# EAGLE schematic LEDMatrixi (EAGLE 9.6.2)
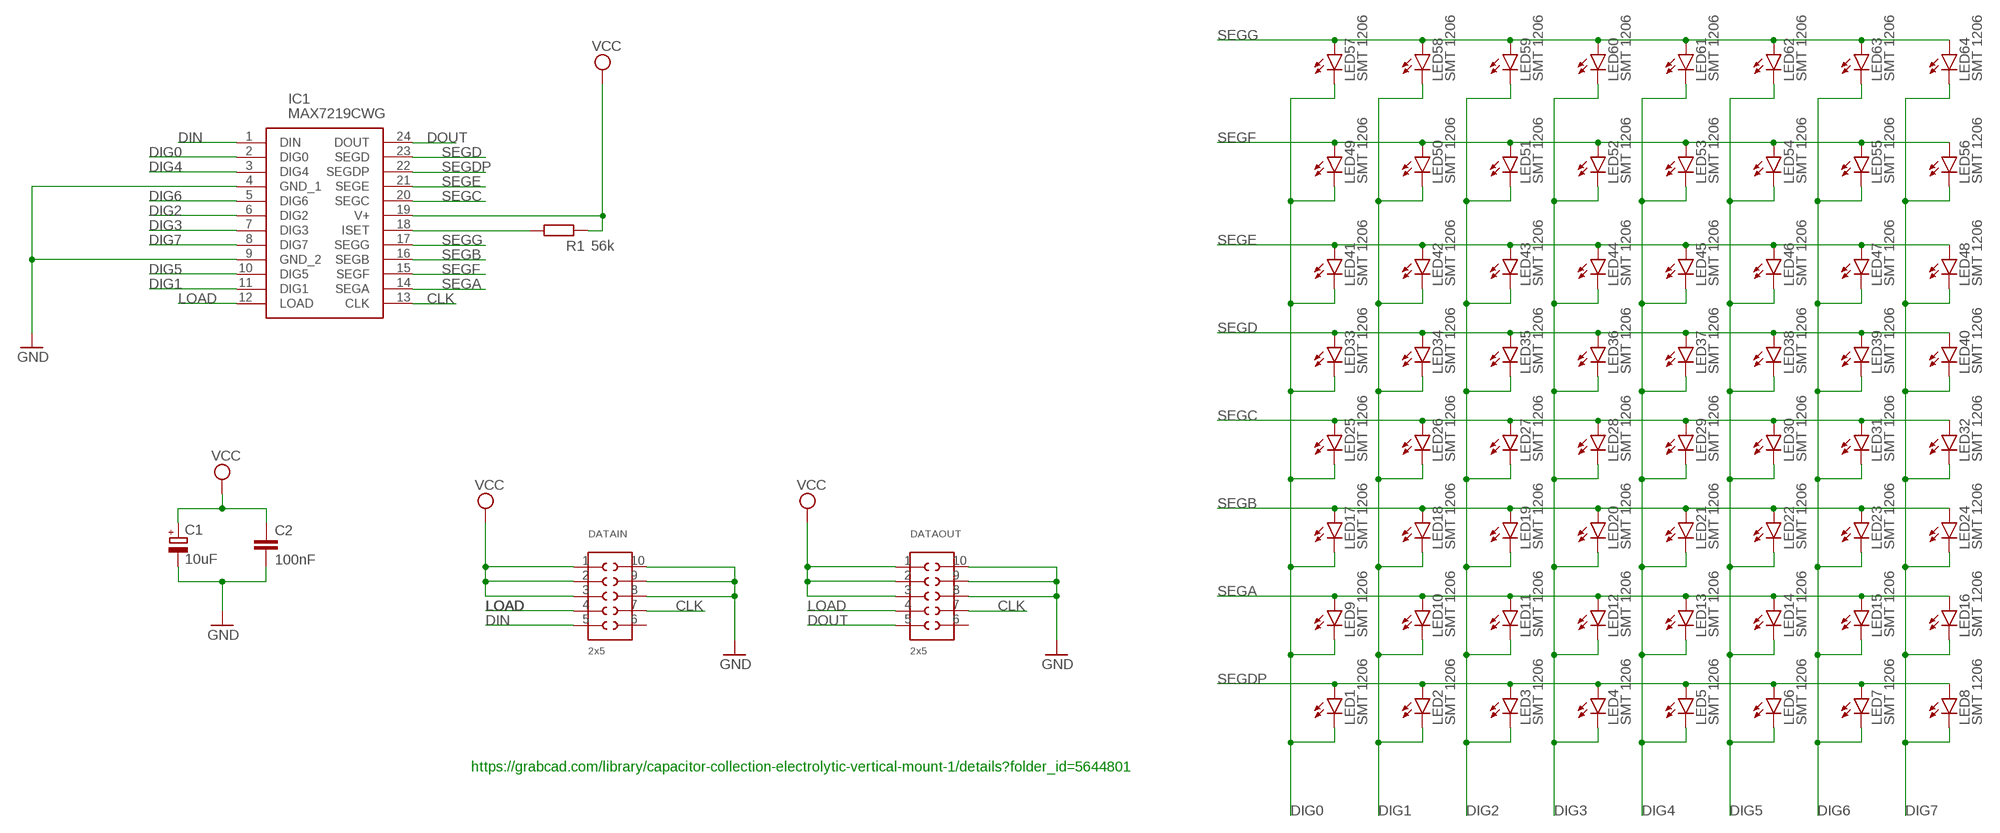
[diagram p0: schematic, sheet 1]

## Parts
C1  10uF  CPOL-EUE5-8.5  [E5-8,5]
C2  100nF  C-EUC1206  [C1206]
DATAIN  2x5  610X1021121  [610X1021121]
DATAOUT  2x5  610X1021121  [610X1021121]
IC1  MAX7219CWG  [SOIC127P1032X265-24N]
LED1  SMT 1206  LEDCHIPLED_1206  [CHIPLED_1206]
LED2  SMT 1206  LEDCHIPLED_1206  [CHIPLED_1206]
LED3  SMT 1206  LEDCHIPLED_1206  [CHIPLED_1206]
LED4  SMT 1206  LEDCHIPLED_1206  [CHIPLED_1206]
LED5  SMT 1206  LEDCHIPLED_1206  [CHIPLED_1206]
LED6  SMT 1206  LEDCHIPLED_1206  [CHIPLED_1206]
LED7  SMT 1206  LEDCHIPLED_1206  [CHIPLED_1206]
LED8  SMT 1206  LEDCHIPLED_1206  [CHIPLED_1206]
LED9  SMT 1206  LEDCHIPLED_1206  [CHIPLED_1206]
LED10  SMT 1206  LEDCHIPLED_1206  [CHIPLED_1206]
LED11  SMT 1206  LEDCHIPLED_1206  [CHIPLED_1206]
LED12  SMT 1206  LEDCHIPLED_1206  [CHIPLED_1206]
LED13  SMT 1206  LEDCHIPLED_1206  [CHIPLED_1206]
LED14  SMT 1206  LEDCHIPLED_1206  [CHIPLED_1206]
LED15  SMT 1206  LEDCHIPLED_1206  [CHIPLED_1206]
LED16  SMT 1206  LEDCHIPLED_1206  [CHIPLED_1206]
LED17  SMT 1206  LEDCHIPLED_1206  [CHIPLED_1206]
LED18  SMT 1206  LEDCHIPLED_1206  [CHIPLED_1206]
LED19  SMT 1206  LEDCHIPLED_1206  [CHIPLED_1206]
LED20  SMT 1206  LEDCHIPLED_1206  [CHIPLED_1206]
LED21  SMT 1206  LEDCHIPLED_1206  [CHIPLED_1206]
LED22  SMT 1206  LEDCHIPLED_1206  [CHIPLED_1206]
LED23  SMT 1206  LEDCHIPLED_1206  [CHIPLED_1206]
LED24  SMT 1206  LEDCHIPLED_1206  [CHIPLED_1206]
LED25  SMT 1206  LEDCHIPLED_1206  [CHIPLED_1206]
LED26  SMT 1206  LEDCHIPLED_1206  [CHIPLED_1206]
LED27  SMT 1206  LEDCHIPLED_1206  [CHIPLED_1206]
LED28  SMT 1206  LEDCHIPLED_1206  [CHIPLED_1206]
LED29  SMT 1206  LEDCHIPLED_1206  [CHIPLED_1206]
LED30  SMT 1206  LEDCHIPLED_1206  [CHIPLED_1206]
LED31  SMT 1206  LEDCHIPLED_1206  [CHIPLED_1206]
LED32  SMT 1206  LEDCHIPLED_1206  [CHIPLED_1206]
LED33  SMT 1206  LEDCHIPLED_1206  [CHIPLED_1206]
LED34  SMT 1206  LEDCHIPLED_1206  [CHIPLED_1206]
LED35  SMT 1206  LEDCHIPLED_1206  [CHIPLED_1206]
LED36  SMT 1206  LEDCHIPLED_1206  [CHIPLED_1206]
LED37  SMT 1206  LEDCHIPLED_1206  [CHIPLED_1206]
LED38  SMT 1206  LEDCHIPLED_1206  [CHIPLED_1206]
LED39  SMT 1206  LEDCHIPLED_1206  [CHIPLED_1206]
LED40  SMT 1206  LEDCHIPLED_1206  [CHIPLED_1206]
LED41  SMT 1206  LEDCHIPLED_1206  [CHIPLED_1206]
LED42  SMT 1206  LEDCHIPLED_1206  [CHIPLED_1206]
LED43  SMT 1206  LEDCHIPLED_1206  [CHIPLED_1206]
LED44  SMT 1206  LEDCHIPLED_1206  [CHIPLED_1206]
LED45  SMT 1206  LEDCHIPLED_1206  [CHIPLED_1206]
LED46  SMT 1206  LEDCHIPLED_1206  [CHIPLED_1206]
LED47  SMT 1206  LEDCHIPLED_1206  [CHIPLED_1206]
LED48  SMT 1206  LEDCHIPLED_1206  [CHIPLED_1206]
LED49  SMT 1206  LEDCHIPLED_1206  [CHIPLED_1206]
LED50  SMT 1206  LEDCHIPLED_1206  [CHIPLED_1206]
LED51  SMT 1206  LEDCHIPLED_1206  [CHIPLED_1206]
LED52  SMT 1206  LEDCHIPLED_1206  [CHIPLED_1206]
LED53  SMT 1206  LEDCHIPLED_1206  [CHIPLED_1206]
LED54  SMT 1206  LEDCHIPLED_1206  [CHIPLED_1206]
LED55  SMT 1206  LEDCHIPLED_1206  [CHIPLED_1206]
LED56  SMT 1206  LEDCHIPLED_1206  [CHIPLED_1206]
LED57  SMT 1206  LEDCHIPLED_1206  [CHIPLED_1206]
LED58  SMT 1206  LEDCHIPLED_1206  [CHIPLED_1206]
LED59  SMT 1206  LEDCHIPLED_1206  [CHIPLED_1206]
LED60  SMT 1206  LEDCHIPLED_1206  [CHIPLED_1206]
LED61  SMT 1206  LEDCHIPLED_1206  [CHIPLED_1206]
LED62  SMT 1206  LEDCHIPLED_1206  [CHIPLED_1206]
LED63  SMT 1206  LEDCHIPLED_1206  [CHIPLED_1206]
LED64  SMT 1206  LEDCHIPLED_1206  [CHIPLED_1206]
R1  56k  R-EU_R1206  [R1206]

## Nets
CLK: DATAIN.7 DATAOUT.7 IC1.13(CLK)
DIG0: IC1.2(DIG0) LED1.C LED9.C LED17.C LED25.C LED33.C LED41.C LED49.C LED57.C
DIG1: IC1.11(DIG1) LED2.C LED10.C LED18.C LED26.C LED34.C LED42.C LED50.C LED58.C
DIG2: IC1.6(DIG2) LED3.C LED11.C LED19.C LED27.C LED35.C LED43.C LED51.C LED59.C
DIG3: IC1.7(DIG3) LED4.C LED12.C LED20.C LED28.C LED36.C LED44.C LED52.C LED60.C
DIG4: IC1.3(DIG4) LED5.C LED13.C LED21.C LED29.C LED37.C LED45.C LED53.C LED61.C
DIG5: IC1.10(DIG5) LED6.C LED14.C LED22.C LED30.C LED38.C LED46.C LED54.C LED62.C
DIG6: IC1.5(DIG6) LED7.C LED15.C LED23.C LED31.C LED39.C LED47.C LED55.C LED63.C
DIG7: IC1.8(DIG7) LED8.C LED16.C LED24.C LED32.C LED40.C LED48.C LED56.C LED64.C
DIN: DATAIN.5 IC1.1(DIN)
DOUT: DATAOUT.5 IC1.24(DOUT)
GND: C1.- C2.2 DATAIN.8 DATAIN.9 DATAIN.10 DATAOUT.8 DATAOUT.9 DATAOUT.10 IC1.4(GND_1) IC1.9(GND_2)
LOAD: DATAIN.4 DATAOUT.4 IC1.12(LOAD)
N$2: IC1.18(ISET) R1.1
SEGA: IC1.14(SEGA) LED9.A LED10.A LED11.A LED12.A LED13.A LED14.A LED15.A LED16.A
SEGB: IC1.16(SEGB) LED17.A LED18.A LED19.A LED20.A LED21.A LED22.A LED23.A LED24.A
SEGC: IC1.20(SEGC) LED25.A LED26.A LED27.A LED28.A LED29.A LED30.A LED31.A LED32.A
SEGD: IC1.23(SEGD) LED33.A LED34.A LED35.A LED36.A LED37.A LED38.A LED39.A LED40.A
SEGDP: IC1.22(SEGDP) LED1.A LED2.A LED3.A LED4.A LED5.A LED6.A LED7.A LED8.A
SEGE: IC1.21(SEGE) LED41.A LED42.A LED43.A LED44.A LED45.A LED46.A LED47.A LED48.A
SEGF: IC1.15(SEGF) LED49.A LED50.A LED51.A LED52.A LED53.A LED54.A LED55.A LED56.A
SEGG: IC1.17(SEGG) LED57.A LED58.A LED59.A LED60.A LED61.A LED62.A LED63.A LED64.A
VCC: C1.+ C2.1 DATAIN.1 DATAIN.2 DATAIN.3 DATAOUT.1 DATAOUT.2 DATAOUT.3 IC1.19(V+) R1.2
Unconnected: DATAIN.6 DATAOUT.6

## Notes on the sheet
- https://grabcad.com/library/capacitor-collection-electrolytic-vertical-mount-1/details?folder_id=5644801

## Library data of the parts
C1 = Clean-Kong:CPOL-EU: POLARIZED CAPACITOR, European symbol
C2 = rcl:C-EU: CAPACITOR, European symbol; SPICEPREFIX: C
DATAIN DATAOUT = Wurth_Elektronik_Electromechanic_Board_to_Board_Connectors_rev16a:610X1021121: WR-PHD 2.54mm Dual SMT Pin Header, 10 Pins =>Code : Con_BTB_PHD_2.54_2_610x1021121(packageing:x = 0: Tube x = 3: Tape & Reel with Cap; 300 pcs/Reel) <http://katalog.we-online.de/media/images/eican/Con_BTB_PHD_2.54_2_6100xx21121_pf2.jpg> 6100xx21121 Details see: http://katalog.we-online.de/en/em/610_0xx_211_21 6103xx21121 Details see: http://katalog.we-online.de/en/em/PHD_2_54_SMT_DUAL_PIN_HEADER_REEL_6103XX21121 2014 (C) Würth Elektronik
IC1 = MAX7219CWG:MAX7219CWG: IC DRVR 7 SEGMNT 8 DIGIT 24SOIC Source: Datasheet <http://datasheets.maximintegrated.com/en/ds/MAX7219-MAX7221.pdf>; DESCRIPTION: IC DRVR 7 SEGMNT 8 DIGIT 24SOIC; HEIGHT: 2.65mm; MANUFACTURER_NAME: Maxim Integrated; MANUFACTURER_PART_NUMBER: MAX7219CWG
LED1-LED64 = led:LED: LED OSRAM: - CHIPLED LG R971, LG N971, LY N971, LG Q971, LY Q971, LO R971, LY R971 LH N974, LH R974 LS Q976, LO Q976, LY Q976 LO Q996 - Hyper CHIPLED LW Q18S LB Q993, LB Q99A, LB R99A - SideLED LS A670, LO A670, LY A670, LG A670, LP A670 LB A673, LV A673, LT A673, LW A673 LH A674 LY A675 LS A676, LA A676, LO A676, LY A676, LW A676 LS A679, LY A679, LG A679 - Hyper Micro SIDELED® LS Y876, LA Y876, LO Y876, LY Y876 LT Y87S - SmartLED LW L88C, LW L88S LB L89C, LB L89S, LG L890 LS L89K, LO L89K, LY L89K LS L896, LA L896, LO L896, LY L896 - TOPLED LS T670, LO T670, LY T670, LG T670, LP T670 LSG T670, LSP T670, LSY T670, LOP T670, LYG T670 LG T671, LOG T671, LSG T671 LB T673, LV T673, LT T673, LW T673 LH T674 LS T676, LA T676, LO T676, LY T676, LB T676, LH T676, LSB T676, LW T676 LB T67C, LV T67C, LT T67C, LS T67K, LO T67K, LY T67K, LW E67C LS E67B, LA E67B, LO E67B, LY E67B, LB E67C, LV E67C, LT E67C LW T67C LS T679, LY T679, LG T679 LS T770, LO T770, LY T770, LG T770, LP T770 LB T773, LV T773, LT T773, LW T773 LH T774 LS E675, LA E675, LY E675, LS T675 LS T776, LA T776, LO T776, LY T776, LB T776 LHGB T686 LT T68C, LB T68C - Hyper Mini TOPLED® LB M676 - Mini TOPLED Santana® LG M470 LS M47K, LO M47K, LY M47K Source: http://www.osram.convergy.de LUXEON: - LUMILED® LXK2-PW12-R00, LXK2-PW12-S00, LXK2-PW14-U00, LXK2-PW14-V00 LXK2-PM12-R00, LXK2-PM12-S00, LXK2-PM14-U00 LXK2-PE12-Q00, LXK2-PE12-R00, LXK2-PE12-S00, LXK2-PE14-T00, LXK2-PE14-U00 LXK2-PB12-K00, LXK2-PB12-L00, LXK2-PB12-M00, LXK2-PB14-N00, LXK2-PB14-P00, LXK2-PB14-Q00 LXK2-PR12-L00, LXK2-PR12-M00, LXK2-PR14-Q00, LXK2-PR14-R00 LXK2-PD12-Q00, LXK2-PD12-R00, LXK2-PD12-S00 LXK2-PH12-R00, LXK2-PH12-S00 LXK2-PL12-P00, LXK2-PL12-Q00, LXK2-PL12-R00 Source: www.luxeon.com KINGBRIGHT: KA-3528ASYC Source: www.kingbright.com
R1 = rcl:R-EU_: RESISTOR, European symbol; SPICEPREFIX: R